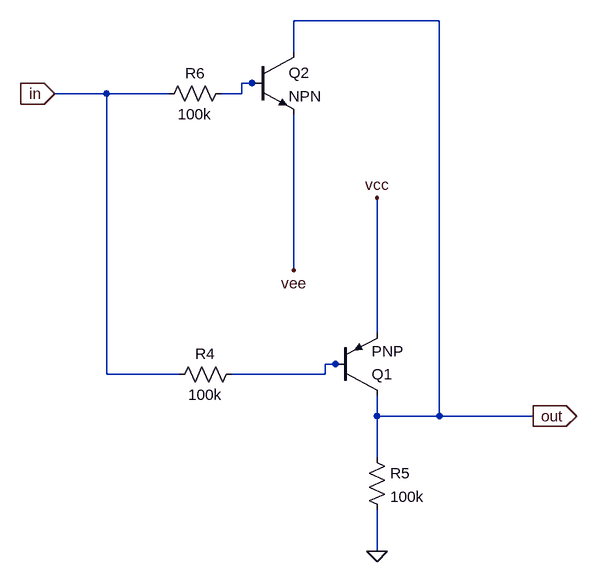
[diagram p0: schematic TNOT.asc]
TNOT.asc, the LTspice schematic file:
Version 4
SHEET 1 880 680
WIRE -512 -256 -736 -256
WIRE -736 -208 -736 -256
WIRE -800 -160 -816 -160
WIRE -784 -160 -800 -160
WIRE -1024 -144 -1104 -144
WIRE -928 -144 -1024 -144
WIRE -816 -144 -816 -160
WIRE -816 -144 -848 -144
WIRE -736 128 -736 -112
WIRE -608 224 -608 16
WIRE -672 272 -688 272
WIRE -656 272 -672 272
WIRE -1024 288 -1024 -144
WIRE -912 288 -1024 288
WIRE -688 288 -688 272
WIRE -688 288 -832 288
WIRE -608 352 -608 320
WIRE -512 352 -512 -256
WIRE -512 352 -608 352
WIRE -368 352 -512 352
WIRE -608 416 -608 352
WIRE -608 560 -608 496
FLAG -368 352 out
IOPIN -368 352 Out
FLAG -608 560 0
FLAG -608 16 vcc
FLAG -736 128 vee
FLAG -1104 -144 in
IOPIN -1104 -144 In
SYMBOL Res -816 272 R90
WINDOW 0 0 56 VBottom 2
WINDOW 3 32 56 VTop 2
SYMATTR InstName R4
SYMATTR Value 100k
SYMBOL Res -624 400 R0
SYMATTR InstName R5
SYMATTR Value 100k
SYMBOL pnp -672 320 M180
SYMATTR InstName Q1
SYMBOL Res -832 -160 R90
WINDOW 0 0 56 VBottom 2
WINDOW 3 32 56 VTop 2
SYMATTR InstName R6
SYMATTR Value 100k
SYMBOL npn -800 -208 R0
SYMATTR InstName Q2

The netlist it stands for:
* TNOT.asc
R4 N002 in 100k
R5 out 0 100k
Q1 out N002 vcc 0 PNP
R6 N001 in 100k
Q2 out N001 vee 0 NPN
.model NPN NPN
.model PNP PNP
.lib standard.bjt
.backanno
.end